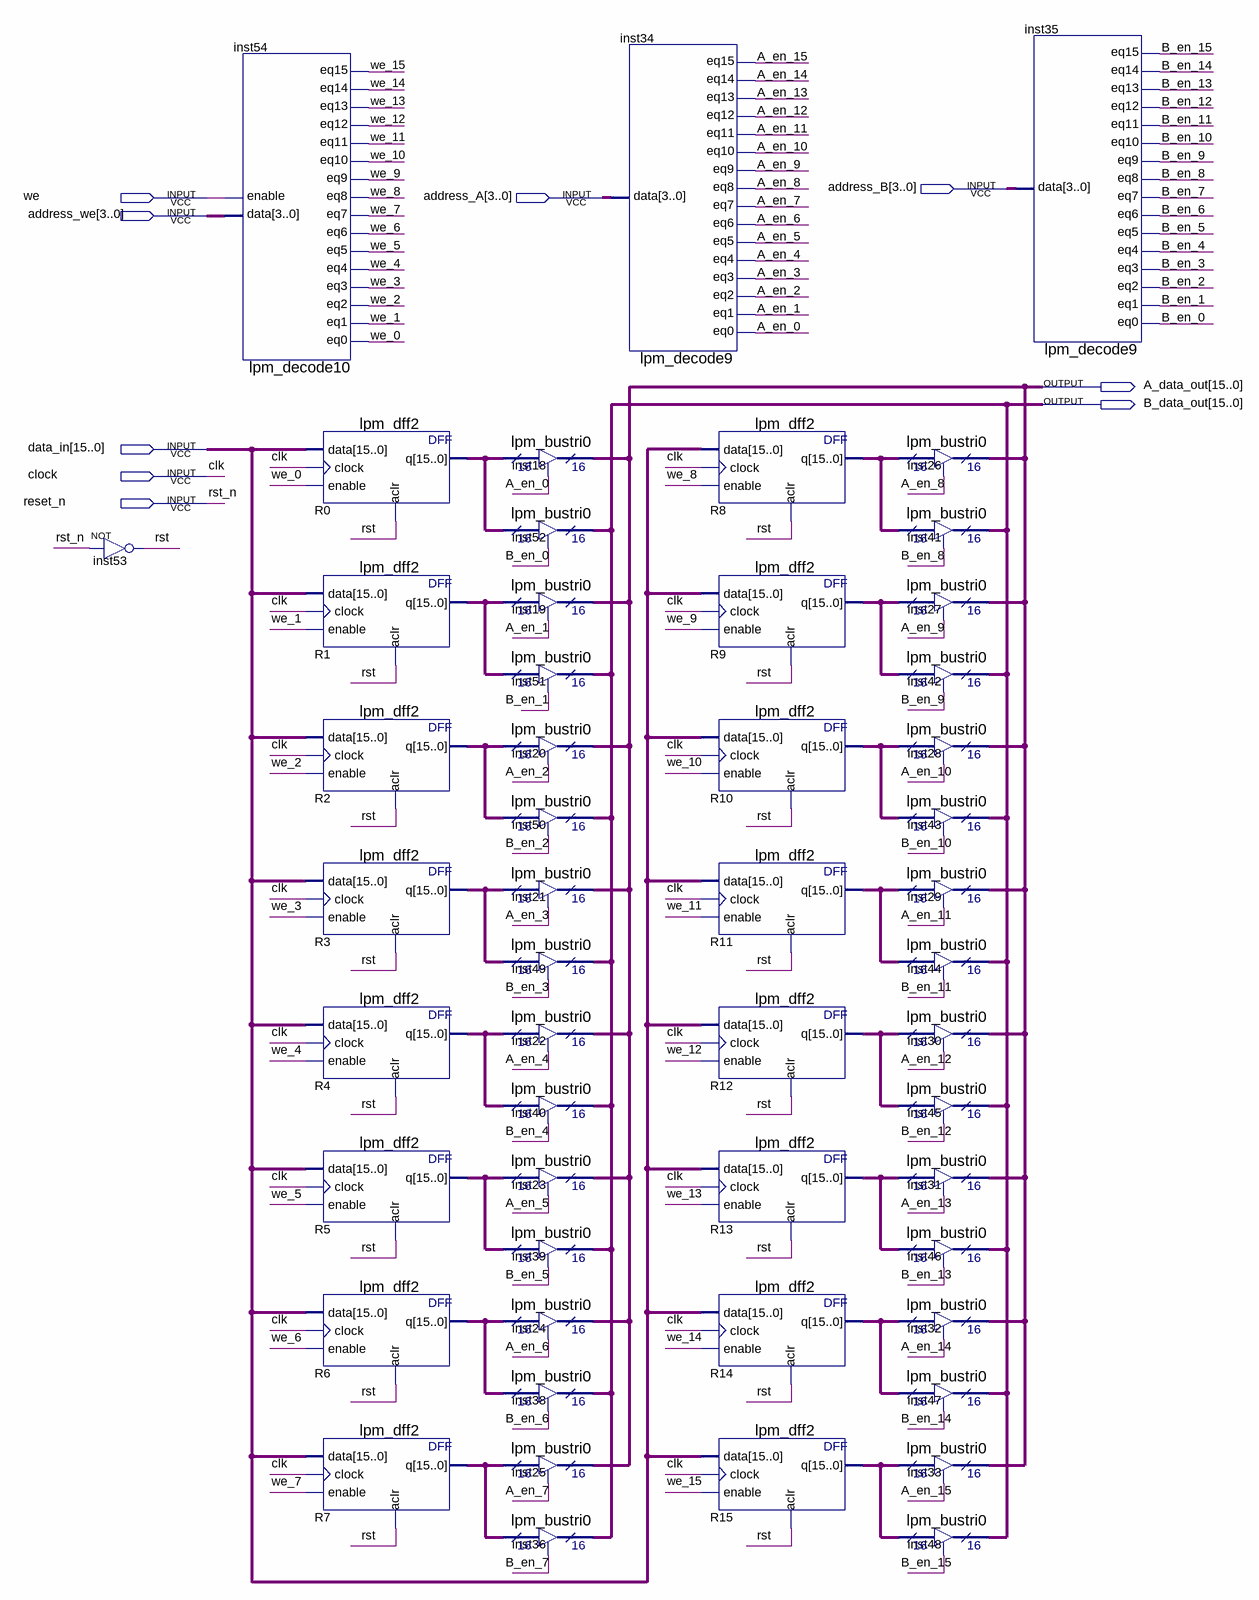
[diagram p0: schematic sheet]
// Quartus schematic reg_file_unit.bdf as structural Verilog: 52 symbols, 9 pins
module reg_file_unit (
  input  [3:0] address_B,
  input  we,
  input  [3:0] address_A,
  input  [3:0] address_we,
  input  [15:0] data_in,
  input  clock,
  input  reset_n,
  output [15:0] A_data_out,
  output [15:0] B_data_out
);

  wire A_en_0, A_en_1, A_en_2, A_en_3, A_en_4, A_en_5, A_en_6, A_en_7, A_en_8, A_en_9, A_en_10, A_en_11,
       A_en_12, A_en_13, A_en_14, A_en_15, B_en_0, B_en_1, B_en_2, B_en_3, B_en_4, B_en_5, B_en_6, B_en_7,
       B_en_8, B_en_9, B_en_10, B_en_11, B_en_12, B_en_13, B_en_14, B_en_15, rst, we_0, we_1, we_2, we_3,
       we_4, we_5, we_6, we_7, we_8, we_9, we_10, we_11, we_12, we_13, we_14, we_15;
  wire [15:0] R0_q, R1_q, R2_q, R3_q, R4_q, R5_q, R6_q, R7_q, R8_q, R9_q, R10_q, R11_q, R12_q, R13_q, R14_q,
       R15_q;

  not inst53 (rst, reset_n);
  lpm_decode10 inst54 (
    .data(address_we), .enable(we), .eq0(we_0), .eq1(we_1), .eq2(we_2), .eq3(we_3), .eq4(we_4), .eq5(we_5),
    .eq6(we_6), .eq7(we_7), .eq8(we_8), .eq9(we_9), .eq10(we_10), .eq11(we_11), .eq12(we_12), .eq13(we_13),
    .eq14(we_14), .eq15(we_15));
  lpm_dff2 R0 (.data(data_in), .clock(clock), .enable(we_0), .aclr(rst), .q(R0_q));
  lpm_dff2 R1 (.data(data_in), .clock(clock), .enable(we_1), .aclr(rst), .q(R1_q));
  lpm_dff2 R2 (.data(data_in), .clock(clock), .enable(we_2), .aclr(rst), .q(R2_q));
  lpm_dff2 R3 (.data(data_in), .clock(clock), .enable(we_3), .aclr(rst), .q(R3_q));
  lpm_dff2 R4 (.data(data_in), .clock(clock), .enable(we_4), .aclr(rst), .q(R4_q));
  lpm_dff2 R5 (.data(data_in), .clock(clock), .enable(we_5), .aclr(rst), .q(R5_q));
  lpm_dff2 R6 (.data(data_in), .clock(clock), .enable(we_6), .aclr(rst), .q(R6_q));
  lpm_dff2 R7 (.data(data_in), .clock(clock), .enable(we_7), .aclr(rst), .q(R7_q));
  lpm_bustri0 inst18 (.enabledt(A_en_0), .data(R0_q), .tridata(A_data_out));
  lpm_bustri0 inst52 (.enabledt(B_en_0), .data(R0_q), .tridata(B_data_out));
  lpm_bustri0 inst19 (.enabledt(A_en_1), .data(R1_q), .tridata(A_data_out));
  lpm_bustri0 inst51 (.enabledt(B_en_1), .data(R1_q), .tridata(B_data_out));
  lpm_bustri0 inst20 (.enabledt(A_en_2), .data(R2_q), .tridata(A_data_out));
  lpm_bustri0 inst50 (.enabledt(B_en_2), .data(R2_q), .tridata(B_data_out));
  lpm_bustri0 inst21 (.enabledt(A_en_3), .data(R3_q), .tridata(A_data_out));
  lpm_bustri0 inst49 (.enabledt(B_en_3), .data(R3_q), .tridata(B_data_out));
  lpm_bustri0 inst22 (.enabledt(A_en_4), .data(R4_q), .tridata(A_data_out));
  lpm_bustri0 inst40 (.enabledt(B_en_4), .data(R4_q), .tridata(B_data_out));
  lpm_bustri0 inst23 (.enabledt(A_en_5), .data(R5_q), .tridata(A_data_out));
  lpm_bustri0 inst39 (.enabledt(B_en_5), .data(R5_q), .tridata(B_data_out));
  lpm_bustri0 inst24 (.enabledt(A_en_6), .data(R6_q), .tridata(A_data_out));
  lpm_bustri0 inst38 (.enabledt(B_en_6), .data(R6_q), .tridata(B_data_out));
  lpm_bustri0 inst25 (.enabledt(A_en_7), .data(R7_q), .tridata(A_data_out));
  lpm_bustri0 inst36 (.enabledt(B_en_7), .data(R7_q), .tridata(B_data_out));
  lpm_decode9 inst34 (
    .data(address_A), .eq0(A_en_0), .eq1(A_en_1), .eq2(A_en_2), .eq3(A_en_3), .eq4(A_en_4), .eq5(A_en_5),
    .eq6(A_en_6), .eq7(A_en_7), .eq8(A_en_8), .eq9(A_en_9), .eq10(A_en_10), .eq11(A_en_11), .eq12(A_en_12),
    .eq13(A_en_13), .eq14(A_en_14), .eq15(A_en_15));
  lpm_dff2 R8 (.data(data_in), .clock(clock), .enable(we_8), .aclr(rst), .q(R8_q));
  lpm_dff2 R9 (.data(data_in), .clock(clock), .enable(we_9), .aclr(rst), .q(R9_q));
  lpm_dff2 R10 (.data(data_in), .clock(clock), .enable(we_10), .aclr(rst), .q(R10_q));
  lpm_dff2 R11 (.data(data_in), .clock(clock), .enable(we_11), .aclr(rst), .q(R11_q));
  lpm_dff2 R12 (.data(data_in), .clock(clock), .enable(we_12), .aclr(rst), .q(R12_q));
  lpm_dff2 R13 (.data(data_in), .clock(clock), .enable(we_13), .aclr(rst), .q(R13_q));
  lpm_dff2 R14 (.data(data_in), .clock(clock), .enable(we_14), .aclr(rst), .q(R14_q));
  lpm_dff2 R15 (.data(data_in), .clock(clock), .enable(we_15), .aclr(rst), .q(R15_q));
  lpm_bustri0 inst26 (.enabledt(A_en_8), .data(R8_q), .tridata(A_data_out));
  lpm_bustri0 inst41 (.enabledt(B_en_8), .data(R8_q), .tridata(B_data_out));
  lpm_bustri0 inst27 (.enabledt(A_en_9), .data(R9_q), .tridata(A_data_out));
  lpm_bustri0 inst42 (.enabledt(B_en_9), .data(R9_q), .tridata(B_data_out));
  lpm_bustri0 inst28 (.enabledt(A_en_10), .data(R10_q), .tridata(A_data_out));
  lpm_bustri0 inst43 (.enabledt(B_en_10), .data(R10_q), .tridata(B_data_out));
  lpm_bustri0 inst29 (.enabledt(A_en_11), .data(R11_q), .tridata(A_data_out));
  lpm_bustri0 inst44 (.enabledt(B_en_11), .data(R11_q), .tridata(B_data_out));
  lpm_bustri0 inst30 (.enabledt(A_en_12), .data(R12_q), .tridata(A_data_out));
  lpm_bustri0 inst45 (.enabledt(B_en_12), .data(R12_q), .tridata(B_data_out));
  lpm_bustri0 inst31 (.enabledt(A_en_13), .data(R13_q), .tridata(A_data_out));
  lpm_bustri0 inst46 (.enabledt(B_en_13), .data(R13_q), .tridata(B_data_out));
  lpm_bustri0 inst32 (.enabledt(A_en_14), .data(R14_q), .tridata(A_data_out));
  lpm_bustri0 inst47 (.enabledt(B_en_14), .data(R14_q), .tridata(B_data_out));
  lpm_bustri0 inst33 (.enabledt(A_en_15), .data(R15_q), .tridata(A_data_out));
  lpm_bustri0 inst48 (.enabledt(B_en_15), .data(R15_q), .tridata(B_data_out));
  lpm_decode9 inst35 (
    .data(address_B), .eq0(B_en_0), .eq1(B_en_1), .eq2(B_en_2), .eq3(B_en_3), .eq4(B_en_4), .eq5(B_en_5),
    .eq6(B_en_6), .eq7(B_en_7), .eq8(B_en_8), .eq9(B_en_9), .eq10(B_en_10), .eq11(B_en_11), .eq12(B_en_12),
    .eq13(B_en_13), .eq14(B_en_14), .eq15(B_en_15));

  // Other names for the same wires on the sheet: clk = clock; rst_n = reset_n
endmodule
